# EAGLE design Adafruit MMA8451 (EAGLE 6.4)
COMPANY: ADAFRUIT INDUSTRIES; DRAWN: KTOWN; REV: A
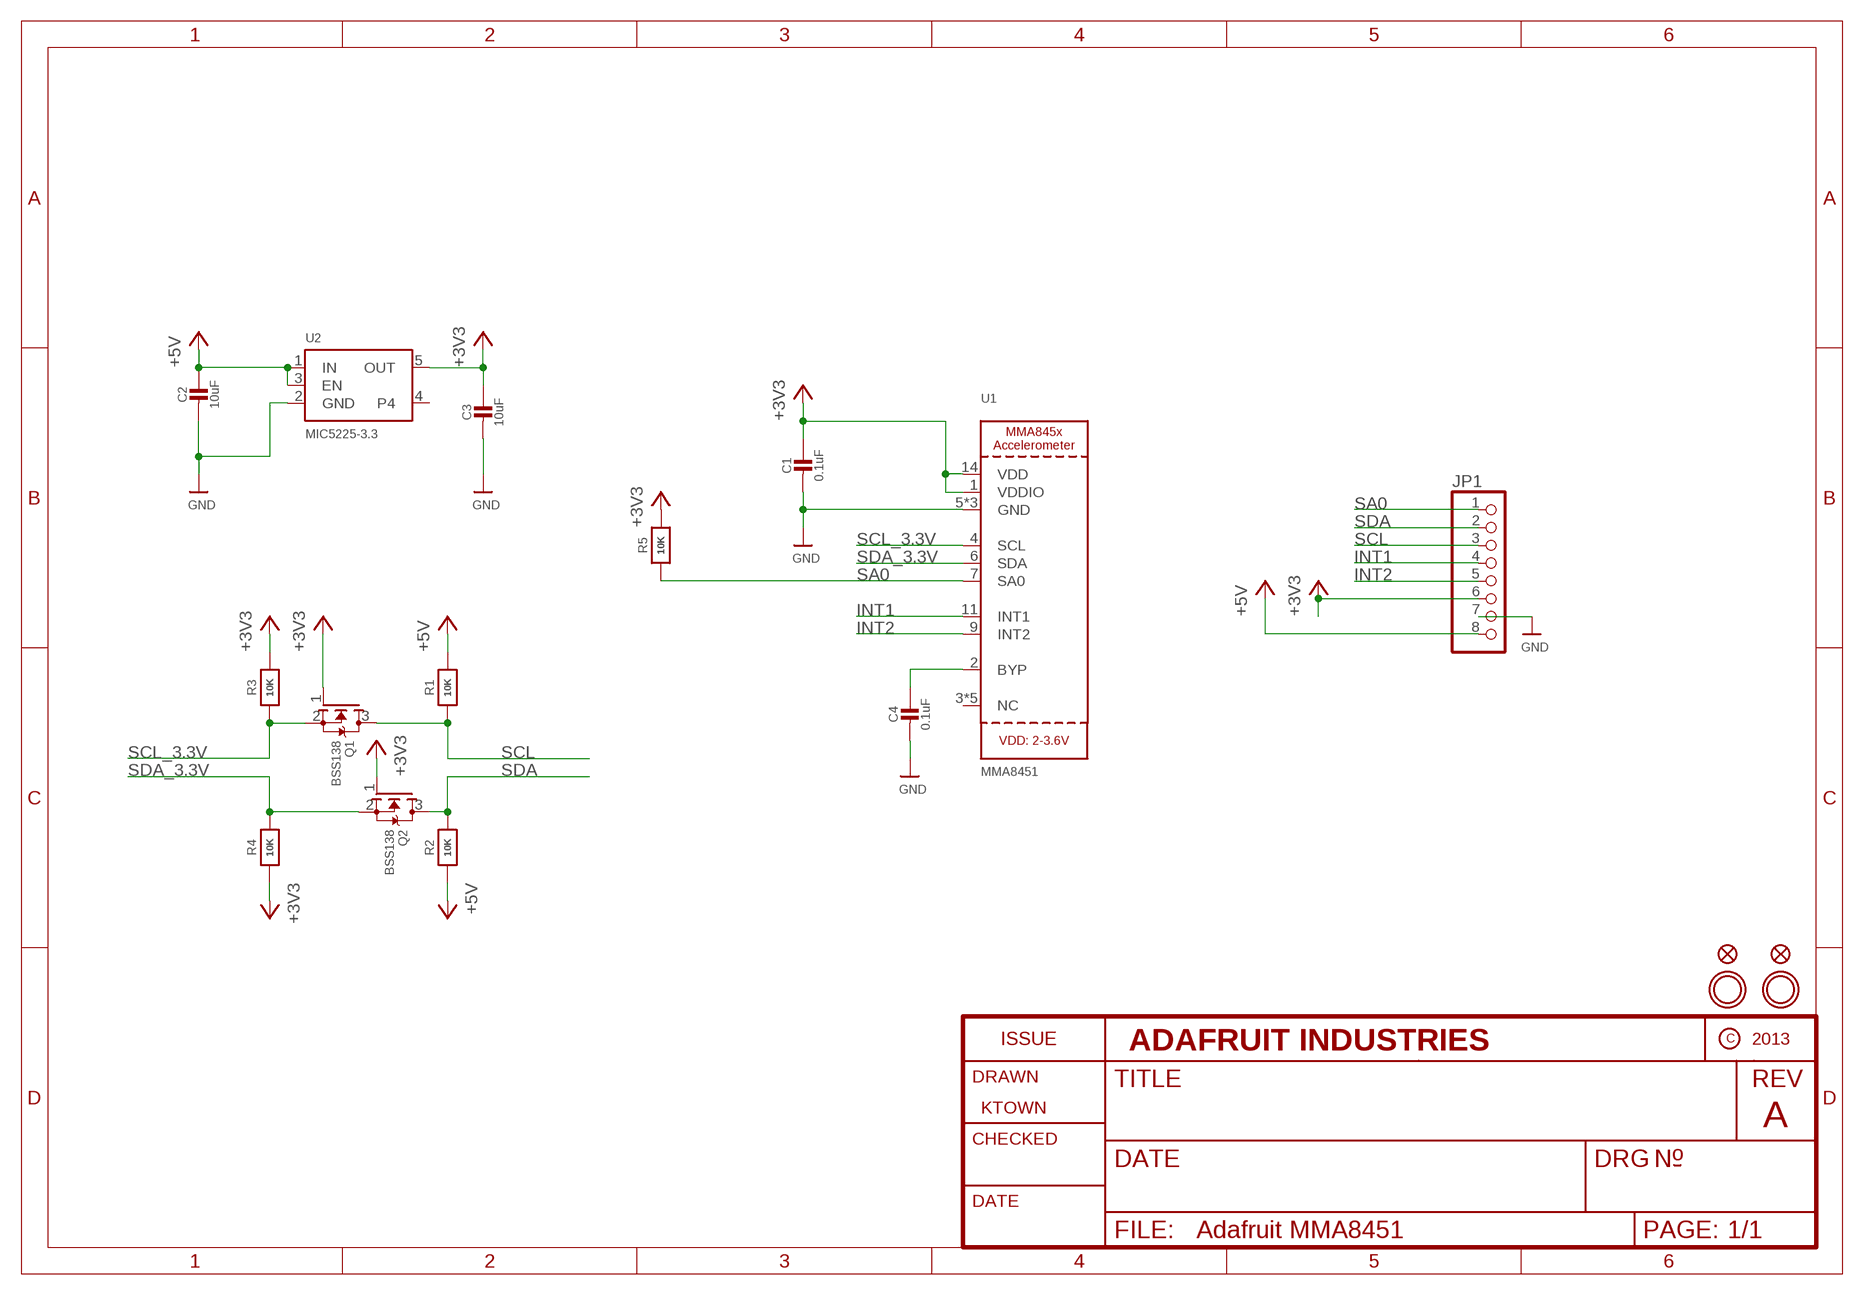
[diagram p0: schematic, sheet 1]

## Parts
C1  0.1uF  CAP_CERAMIC0805-NOOUTLINE  [0805-NO]
C2  10uF  CAP_CERAMIC0805-NOOUTLINE  [0805-NO]
C3  10uF  CAP_CERAMIC0805-NOOUTLINE  [0805-NO]
C4  0.1uF  CAP_CERAMIC0805_10MGAP  [0805_10MGAP]
FID1  FIDUCIAL""  [FIDUCIAL_1MM]
FID2  FIDUCIAL""  [FIDUCIAL_1MM]
JP1  HEADER-1X870MIL  [1X08_ROUND_70]
Q1  BSS138  MOSFET-NWIDE  [SOT23-WIDE]
Q2  BSS138  MOSFET-NWIDE  [SOT23-WIDE]
R1  10K  RESISTOR0805_NOOUTLINE  [0805-NO]
R2  10K  RESISTOR0805_NOOUTLINE  [0805-NO]
R3  10K  RESISTOR0805_NOOUTLINE  [0805-NO]
R4  10K  RESISTOR0805_NOOUTLINE  [0805-NO]
R5  10K  RESISTOR0805_NOOUTLINE  [0805-NO]
U1  MMA8451  ACCEL_MMA845X  [MMA845X_QFN_16MM]
U2  MIC5225-3.3  VREG_SOT23-5  [SOT23-5]
U$3  MOUNTINGHOLE2.5  [MOUNTINGHOLE_2.5_PLATED]
U$6  MOUNTINGHOLE2.5  [MOUNTINGHOLE_2.5_PLATED]

## Nets
+3V3: C1.1 C3.1 JP1.6 Q1.1(G) Q2.1(G) R3.2 R4.1 R5.2 U1.1(VDDIO) U1.14(VDD) U2.5(OUT)
GND: C1.2 C2.2 C3.2 C4.2 JP1.7 U1.5(GND) U1.10(GND) U1.12(GND) U2.2(GND)
INT1: JP1.4 U1.11(INT1)
INT2: JP1.5 U1.9(INT2)
N$1: C4.1 U1.2(BYP)
SA0: JP1.1 R5.1 U1.7(SA0)
SCL: JP1.3 Q1.3(D) R1.1
SCL_3.3V: Q1.2(S) R3.1 U1.4(SCL)
SDA: JP1.2 Q2.3(D) R2.2
SDA_3.3V: Q2.2(S) R4.2 U1.6(SDA)
VIN: C2.1 JP1.8 R1.2 R2.1 U2.1(IN) U2.3(EN) ; supply symbol labelled +5V
Unconnected: U1.3(NC) U1.8(NC) U1.13(NC) U1.15(NC) U1.16(NC) U2.4

## Library data of the parts
C1-C4 = microbuilder:CAP_CERAMIC: Ceramic Capacitors For new designs, use the packages preceded by an '_' character since they are more reliable: The following footprints should be used on most boards: _0402 - Standard footprint for regular board layouts _0603 - Standard footprint for regular board layouts _0805 - Standard footprint for regular board layouts _1206 - Standard footprint for regular board layouts For extremely tight-pitch boards where space is at a premium, the following 'micro-pitch' footprints can be used (smaller pads, no silkscreen outline, etc.): _0402MP - Micro-pitch footprint for very dense/compact boards _0603MP - Micro-pitch footprint for very dense/compact boards _0805MP - Micro-pitch footprint for very dense/compact boards _1206MP - Micro-pitch footprint for very dense/compact boards
FID1 FID2 = microbuilder:FIDUCIAL: Fiducial Alignment Points Various fiducial points for machine vision alignment.; BOM: EXCLUDE
JP1 = microbuilder:HEADER-1X8: PIN HEADER
Q1 Q2 = microbuilder:MOSFET-N: N-Channel Mosfet LEGEND VDS: Voltage Drain-Source ID: Drain Current RDS(ON): Drain-Source On-State Resistance VGS(TH): Gate-Source Threshold Voltage CISS: Drain-Source Input Capacitance SOT-23 Name VDS ID RDS(ON) VGS(TH) CISS Order Number 2N7002E 60V 260mA 2.5 Ohm 2.5V @ 250uA 26.7pF @ 25V 2N7002ET1GOSTR-ND BSH103 30V 850mA 400 mOhm 400mV @ 1mA 83pF @ 24V BSH103,235-ND BSS138 60V 320mA 1.6 Ohm 1.5V @ 250uA 50pF @ 10V Mouser: 771-BSS138PW115 DMN2075U-7 20V 4.2A 38 mOhm 1V @ 250 uA 594.3pF @ 10V DMN2075U-7DICT-ND * BSS138 good choice for I2C level-shifting POWERPAK 1212-8 Name VDS ID RDS(ON) VGS(TH) CISS Order Number Si7308DN 60V 6A 58 mOhm 3V @ 250uA 665pF @ 15V SI7308DN-T1-E3CT-ND
R1-R5 = microbuilder:RESISTOR: Resistors For new designs, use the packages preceded by an '_' character since they are more reliable: The following footprints should be used on most boards: _0402 - Standard footprint for regular board layouts _0603 - Standard footprint for regular board layouts _0805 - Standard footprint for regular board layouts _1206 - Standard footprint for regular board layouts For extremely tight-pitch boards where space is at a premium, the following 'micro-pitch' footprints can be used (smaller pads, no silkscreen outline, etc.): _0402MP - Micro-pitch footprint for very dense/compact boards _0603MP - Micro-pitch footprint for very dense/compact boards _0805MP - Micro-pitch footprint for very dense/compact boards _1206MP - Micro-pitch footprint for very dense/compact boards
U1 = microbuilder:ACCEL_MMA845X: MMA845x 3-Axis ±2g/±4g/±8g Accelerometer
U2 = microbuilder:VREG_SOT23-5: SOT23-5 Fixed Voltage Regulators Part Current Out V Out V In V Dropout θJA (°C/W) TJ (°C) Digikey Part No. ADP121 150mA 3.3V 3.4-5.5V 0.09V @ 150mA -- -- ADP121-AUJZ33R7CT-ND ADP121 150mA 3.0V 3.1-5.5V 0.09V @ 150mA -- -- ADP121-AUJZ30R7CT-ND ADP122 300mA 3.3V 3.4-5.5V 0.085V @ 300mA -- -- ADP122AUJZ-3.3-R7CT-ND ADP1712 300mA 3.3V 3.5-5.5V 0.17V @ 300mA -- -- ADP1712AUJZ-3.3-R7TR-ND AP7311 (Low Cost) 150mA 3.3V 3.5-6V 0.15V @ 150mA -- -- AP7311-33WG-7DICT-ND LD39015M18R 150mA 1.8V 1.9V-5.5V 0.08V @ 100mA -- -- 497-6977-1-ND LP2985A-33DBVR 150mA 3.3V 3.3-16V 0.28V @ 150mA 206 150 296-18479-1-ND MCP1824T-3302E/OT 300mA 3.3V 3.5V-6V 0.2V @ 300mA -- -- MCP1824T-3302E/OTCT-ND MIC5205-2.5YM5 TR 150mA 2.5V 2.7-16V 0.165V @ 150mA -- -- 576-1257-2-ND MIC5205-3.0YM5 TR 150mA 3.0V 3.2V-16V 0.165V @ 150mA -- -- 576-1258-2-ND MIC5205-3.3YM5 TR 150mA 3.3V 3.5V-16V 0.165V @ 150mA -- -- 576-1259-2-ND TPS780330220 150mA 3.3V+2.2V 3.6-5.5V 250mV Max -- -- 296-23332-1-ND TDA3663/N1,135 100mA 3.3V 3.5-45V 0.18V @ 50mA -- -- 568-5343-1-ND Max operating temp can be calculated using θJA, TJ (max junction temperature), and power in watts. Set the "Maximum Ambient Temperature" until it reaches TJ ("Max Junction Temperature"), which is the absolute limit for safe use of the regulator: Heat Sink Temperature Calculator <http://www.daycounter.com/Calculators/Heat-Sink-Temperature-Calculator.phtml> For example, With 12V source into a 3.3V LP2985 and a 30mA load, we are dissipating (12V-3.3V) * 0.03A = 0.261W. With a θJA of 206 °C/W, a TJ of 150°C, and 261mW we can safely use the chip without a heat sink up to 75°C (=147.1°C Junction Temperature).
U$3 U$6 = microbuilder:MOUNTINGHOLE: Mounting Hole For #2 screws (0.086"/2.18mm width, 0.094"/2.4mm hole) use 2.5mm; BOM: EXCLUDE

## Board
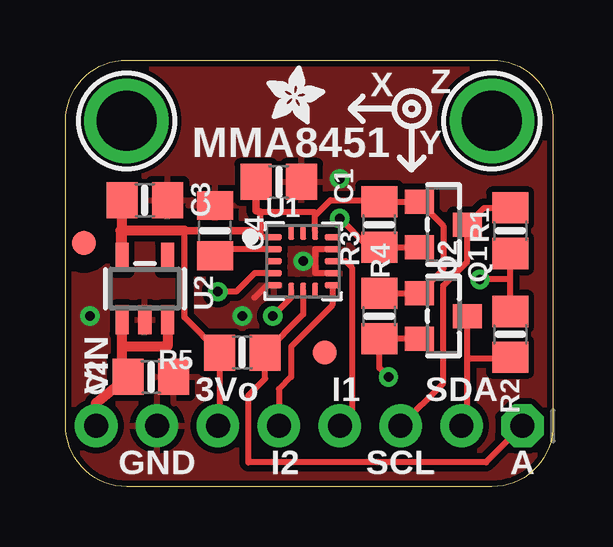
[diagram p1: board, top side]
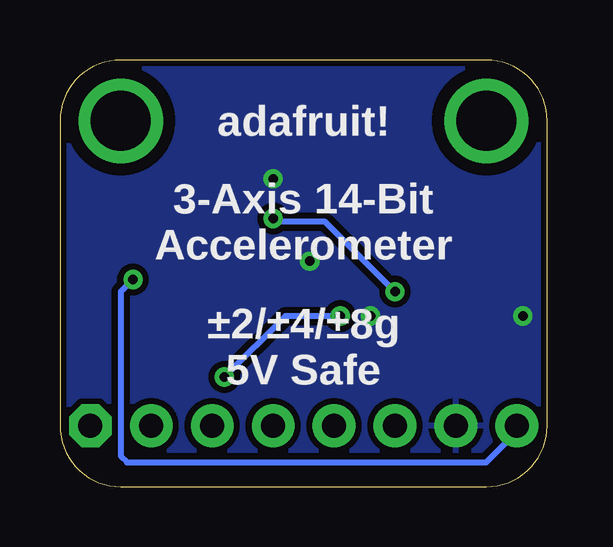
[diagram p2: board, bottom side, seen from below]

Size 20.32 x 17.78 mm. Coordinates in mm from the lower left corner, seen from the top.
Outline: 0,2.54 0,15.24 arc-90 2.54,17.78 17.78,17.78 arc-90 20.32,15.24 20.32,2.54 arc-90 17.78,0 2.54,0 arc-90 0,2.54
Copper layers (1*16): Top 0.035mm / dielectric 1.5mm / Bottom 0.035mm
Design rules "adafruit": minimum track width 8mil, minimum drill 15.5mil, track to track 8mil, track to pad 8mil, pad to pad 8mil, via to via 8mil, smd to smd 8mil, copper to edge 10mil, drill to drill 8mil, minimum pad ring 10mil, minimum via ring 8mil, stop-mask expansion 2mil, vias tented up to drill 20mil, thermal gap 10mil

### Footprints (pad centres in the part's own frame; a part is rotated, then mirrored left to right if it is on the bottom)
0805-NO = smd 1.3 x 1.5: 1 -0.95,0; 2 0.95,0
0805_10MGAP = smd 1.2 x 1.5: 1 -1.05,0; 2 1.05,0
FIDUCIAL_1MM = smd 1 x 1: 1 0,0
1X08_ROUND_70 = drill 1 pad 1.778 octagon: 1 -8.89,0 | drill 1 pad 1.778: 2 -6.35,0; 3 -3.81,0; 4 -1.27,0; 5 1.27,0; 6 3.81,0; 7 6.35,0; 8 8.89,0
SOT23-WIDE = smd 1 x 1.2: 1 -0.95,-1; 2 0.95,-1; 3 0,1
MMA845X_QFN_16MM = smd 0.65 x 0.25: 1 -1.216,1; 2 -1.216,0.5; 3 -1.216,0; 4 -1.216,-0.5; 5 -1.216,-1; 9 1.216,-1; 10 1.216,-0.5; 11 1.216,0; 12 1.216,0.5; 13 1.216,1 | smd 0.25 x 0.65: 6 -0.5,-1.216; 7 0,-1.216; 8 0.5,-1.216; 14 0.5,1.216; 15 0,1.216; 16 -0.5,1.216
SOT23-5 = smd 0.55 x 1.2: 1 -0.95,-1.3; 2 0,-1.3; 3 0.95,-1.3; 4 0.95,1.3; 5 -0.95,1.3
MOUNTINGHOLE_2.5_PLATED = drill 2.5 pad 3.2: P$1 0,0

### Placement (x,y rotation side)
C1  8.89,12.7 0 top
C2  3.56,4.57 0 top
C3  3.3,11.94 0 top
C4  6.22,10.67 90 top
FID1  0.76,10.16 0 top
FID2  10.79,5.59 0 top
JP1  10.16,2.54 180 top
Q1  15.75,10.92 270 top
Q2  15.75,7.11 270 top
R1  18.54,10.67 270 top
R2  18.54,6.35 270 top
R3  13.08,10.92 90 top
R4  13.08,7.11 270 top
R5  7.37,5.59 180 top
U1  9.91,9.4 0 top
U2  3.3,8.26 0 top
U$3  2.54,15.24 0 top
U$6  17.78,15.24 0 top
U$10  [ADAFRUIT_2.5MM]  8.38,15.11 0 top

### Tracks (layer width: path | path; a pad name or v marks a point on that pad's centre or on a via)
+3V3
  Top 0.254: U1.1 8.14,10.4 8.14,10.79 8.13,11.43 10.41,11.43 | U1.14 10.41,11.43 | R4.1 Q2.1 15.75,9.06 15.75,10.87 Q1.1 R3.2 13.02,11.94 11.05,11.94 10.41,11.3 10.41,11.43 | 4.95,10.67 4.95,7.05 R5.2 6.42,2.54 JP1.6
  Top 0.305: C1.1 7.94,11.5 8.13,11.43 | 8.14,10.79 8.01,10.67 4.95,10.67
  Top 0.406: C3.1 U2.5 2.29,9.87 2.29,10.67 4.95,10.67
GND  (via drill 0.39)
  Top 0.254: U1.10 10.41,8.9 10.41,9.91 U1.12 | U1.5 8.4,8.4 7.87,7.87
  other vias: 1.02,7.11 7.37,7.11 11.43,12.83 9.91,9.4
  pour Top (isolate 0.254): 0,2.54 0,15.24 arc-90 2.54,17.78 17.78,17.53 arc-90 20.32,14.99 20.32,2.54 arc-90 17.78,0 2.54,0 arc-90
  pour Bottom (isolate 0.254): 0,2.54 0,15.24 arc-90 2.54,17.78 17.78,17.53 arc-90 20.32,14.99 20.32,2.54 arc-90 17.78,0 2.54,0 arc-90
INT1
  Top 0.254: U1.11 11.68,9.4 11.94,9.14 11.94,3.05 JP1.4
INT2
  Top 0.254: JP1.5 8.89,4.06 9.4,4.57 9.4,5.84 11.12,7.57 U1.9
N$1
  Top 0.254: U1.2 6.79,9.9 C4.1
SA0
  Top 0.254: JP1.1 17.53,1.02 7.62,1.02 7.62,3.81 8.32,4.51 R5.1 9.91,7.18 U1.7
SCL
  Top 0.254: R1.1 17.44,11.62 Q1.3 16.75,9.38 15.75,8.38 15.75,4.32 JP1.3
SCL_3.3V  (via drill 0.39)
  Top 0.254: Q1.2 R3.1 12.63,9.97 v11.43,11.18 | U1.4 7.88,8.9 7.11,8.13 v6.35,8.13
  Bottom 0.254: v6.35,8.13 9.27,11.05 11.18,11.05 v11.43,11.18
SDA
  Top 0.254: JP1.2 16.75,2.78 16.75,5.33 | 16.75,5.33 Q2.3 | R2.2 18.48,5.33 16.75,5.33
SDA_3.3V  (via drill 0.39)
  Top 0.254: Q2.2 R4.2 13.08,4.95 v13.46,4.57 | U1.6 9.41,7.88 v8.64,7.11
  Bottom 0.254: v8.64,7.11 10.92,7.11 v13.46,4.57
VIN  (via drill 0.39)
  Top 0.254: R2.1 18.54,8.64 | 18.54,8.64 R1.2 | 18.54,8.64 v17.27,8.64
  Top 0.406: JP1.8 1.27,3.49 C2.1 2.35,5.08 2.35,5.84 | 2.35,5.84 U2.1 | U2.3 4.25,5.84 2.35,5.84
  Bottom 0.254: v17.27,8.64 17.78,8.13 17.78,1.27 17.53,1.02 2.54,1.02 1.27,2.29 JP1.8

### Text on the board
tPlace: X | Z | Y | MMA8451 | VIN | 3Vo | I1 | SDA | GND | I2 | SCL | A
bPlace: adafruit! | 3-Axis 14-Bit / Accelerometer | ±2/±4/±8g / 5V Safe